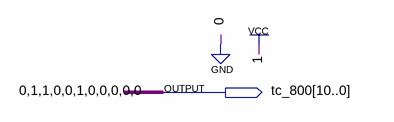
[diagram p0: schematic sheet]
// Quartus schematic tc_800.bdf as structural Verilog: 0 symbols, 1 pins
module tc_800 (
  output [10:0] tc_800
);


  assign tc_800 = 11'b01100100000;
endmodule
